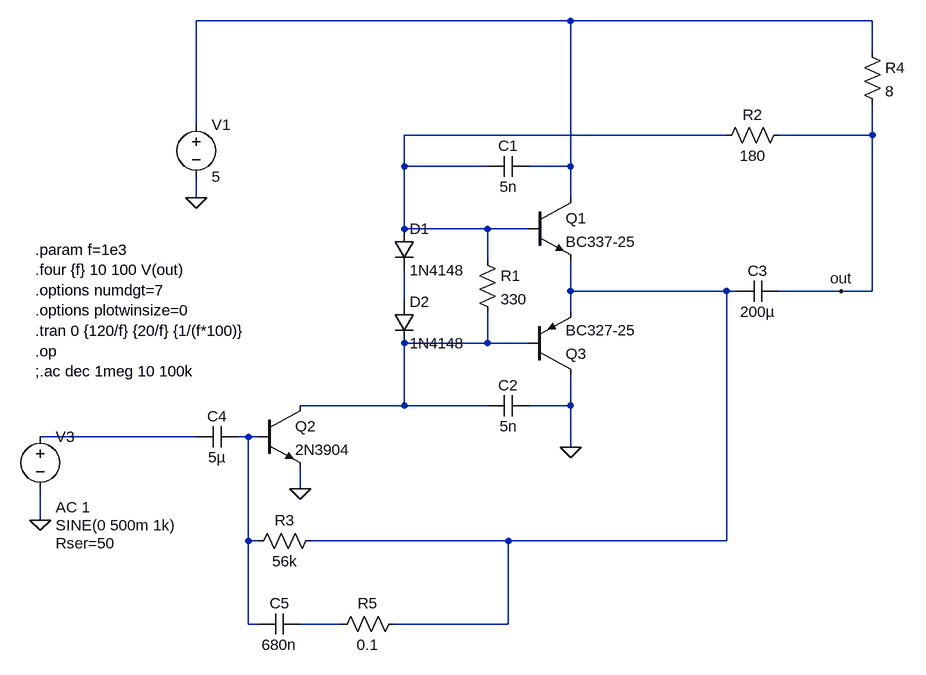
[diagram p0: schematic ITT_Pony13_adjust_bias.asc]
ITT_Pony13_adjust_bias.asc, the LTspice schematic file:
Version 4
SHEET 1 904 736
WIRE 384 -240 -192 -240
WIRE 848 -240 384 -240
WIRE 848 -192 848 -240
WIRE -192 -80 -192 -240
WIRE 624 -64 128 -64
WIRE 848 -64 848 -112
WIRE 848 -64 704 -64
WIRE 128 -16 128 -64
WIRE 256 -16 128 -16
WIRE 384 -16 384 -240
WIRE 384 -16 320 -16
WIRE -192 32 -192 0
WIRE 384 32 384 -16
WIRE 128 80 128 -16
WIRE 256 80 128 80
WIRE 320 80 256 80
WIRE 256 128 256 80
WIRE 384 176 384 128
WIRE 624 176 384 176
WIRE 640 176 624 176
WIRE 800 176 704 176
WIRE 848 176 848 -64
WIRE 848 176 800 176
WIRE 128 192 128 144
WIRE 384 208 384 176
WIRE 256 256 256 208
WIRE 256 256 128 256
WIRE 320 256 256 256
WIRE 128 352 128 256
WIRE 128 352 -32 352
WIRE 256 352 128 352
WIRE 384 352 384 304
WIRE 384 352 320 352
WIRE -192 400 -432 400
WIRE -112 400 -128 400
WIRE -96 400 -112 400
WIRE 384 416 384 352
WIRE -32 480 -32 448
WIRE -432 528 -432 480
WIRE -112 560 -112 400
WIRE -96 560 -112 560
WIRE 288 560 -16 560
WIRE 624 560 624 176
WIRE 624 560 288 560
WIRE -112 688 -112 560
WIRE -96 688 -112 688
WIRE 32 688 -32 688
WIRE 288 688 288 560
WIRE 288 688 112 688
FLAG -192 32 0
FLAG -432 528 0
FLAG -32 480 0
FLAG 384 416 0
FLAG 800 176 out
DATAFLAG 512 176 ""
DATAFLAG 32 352 ""
DATAFLAG 496 -64 ""
SYMBOL npn 320 32 R0
SYMATTR InstName Q1
SYMATTR Value BC337-25
SYMBOL npn -96 352 R0
SYMATTR InstName Q2
SYMATTR Value 2N3904
SYMBOL pnp 320 304 M180
SYMATTR InstName Q3
SYMATTR Value BC327-25
SYMBOL res 240 112 R0
SYMATTR InstName R1
SYMATTR Value 330
SYMBOL diode 112 80 R0
SYMATTR InstName D1
SYMATTR Value 1N4148
SYMBOL diode 112 192 R0
SYMATTR InstName D2
SYMATTR Value 1N4148
SYMBOL cap 320 -32 R90
WINDOW 0 0 32 VBottom 2
WINDOW 3 32 32 VTop 2
SYMATTR InstName C1
SYMATTR Value 5n
SYMBOL cap 320 336 R90
WINDOW 0 0 32 VBottom 2
WINDOW 3 32 32 VTop 2
SYMATTR InstName C2
SYMATTR Value 5n
SYMBOL cap 704 160 R90
WINDOW 0 0 32 VBottom 2
WINDOW 3 32 32 VTop 2
SYMATTR InstName C3
SYMATTR Value 200µ
SYMBOL res 720 -80 R90
WINDOW 0 0 56 VBottom 2
WINDOW 3 32 56 VTop 2
SYMATTR InstName R2
SYMATTR Value 180
SYMBOL voltage -192 -96 R0
SYMATTR InstName V1
SYMATTR Value 5
SYMBOL cap -128 384 R90
WINDOW 0 0 32 VBottom 2
WINDOW 3 32 32 VTop 2
SYMATTR InstName C4
SYMATTR Value 5µ
SYMBOL res 0 544 R90
WINDOW 0 0 56 VBottom 2
WINDOW 3 32 56 VTop 2
SYMATTR InstName R3
SYMATTR Value 56k
SYMBOL res 832 -208 R0
SYMATTR InstName R4
SYMATTR Value 8
SYMBOL voltage -432 384 R0
WINDOW 3 24 152 Left 2
WINDOW 123 24 124 Left 2
WINDOW 39 24 180 Left 2
SYMATTR Value SINE(0 500m 1k)
SYMATTR Value2 AC 1
SYMATTR SpiceLine Rser=50
SYMATTR InstName V3
SYMBOL cap -32 672 R90
WINDOW 0 0 32 VBottom 2
WINDOW 3 32 32 VTop 2
SYMATTR InstName C5
SYMATTR Value 680n
SYMBOL res 128 672 R90
WINDOW 0 0 56 VBottom 2
WINDOW 3 32 56 VTop 2
SYMATTR InstName R5
SYMATTR Value 0.1
TEXT -440 112 Left 2 !.param f=1e3\n.four {f} 10 100 V(out)\n.options numdgt=7\n.options plotwinsize=0\n.tran 0 {120/f} {20/f} {1/(f*100)}\n.op\n;.ac dec 1meg 10 100k

The netlist it stands for:
* ITT_Pony13_adjust_bias.asc
Q1 N001 N002 N003 0 BC337-25
Q2 N005 N007 0 0 2N3904
Q3 0 N005 N003 0 BC327-25
R1 N002 N005 330
D1 N002 N004 1N4148
D2 N004 N005 1N4148
C1 N001 N002 5n
C2 0 N005 5n
C3 out N003 200µ
R2 out N002 180
V1 N001 0 5
C4 N007 N006 5µ
R3 N003 N007 56k
R4 N001 out 8
V3 N006 0 SINE(0 500m 1k) AC 1 Rser=50
C5 N008 N007 680n
R5 N003 N008 0.1
.model D D
.lib standard.dio
.model NPN NPN
.model PNP PNP
.lib standard.bjt
.param f=1e3
.four {f} 10 100 V(out)
.options numdgt=7
.options plotwinsize=0
.tran 0 {120/f} {20/f} {1/(f*100)}
.op
;.ac dec 1meg 10 100k
.backanno
.end